# EAGLE design EL-100-020-030-AnalogOUT (EAGLE 6.6.0)

## Sheet 1 of 2
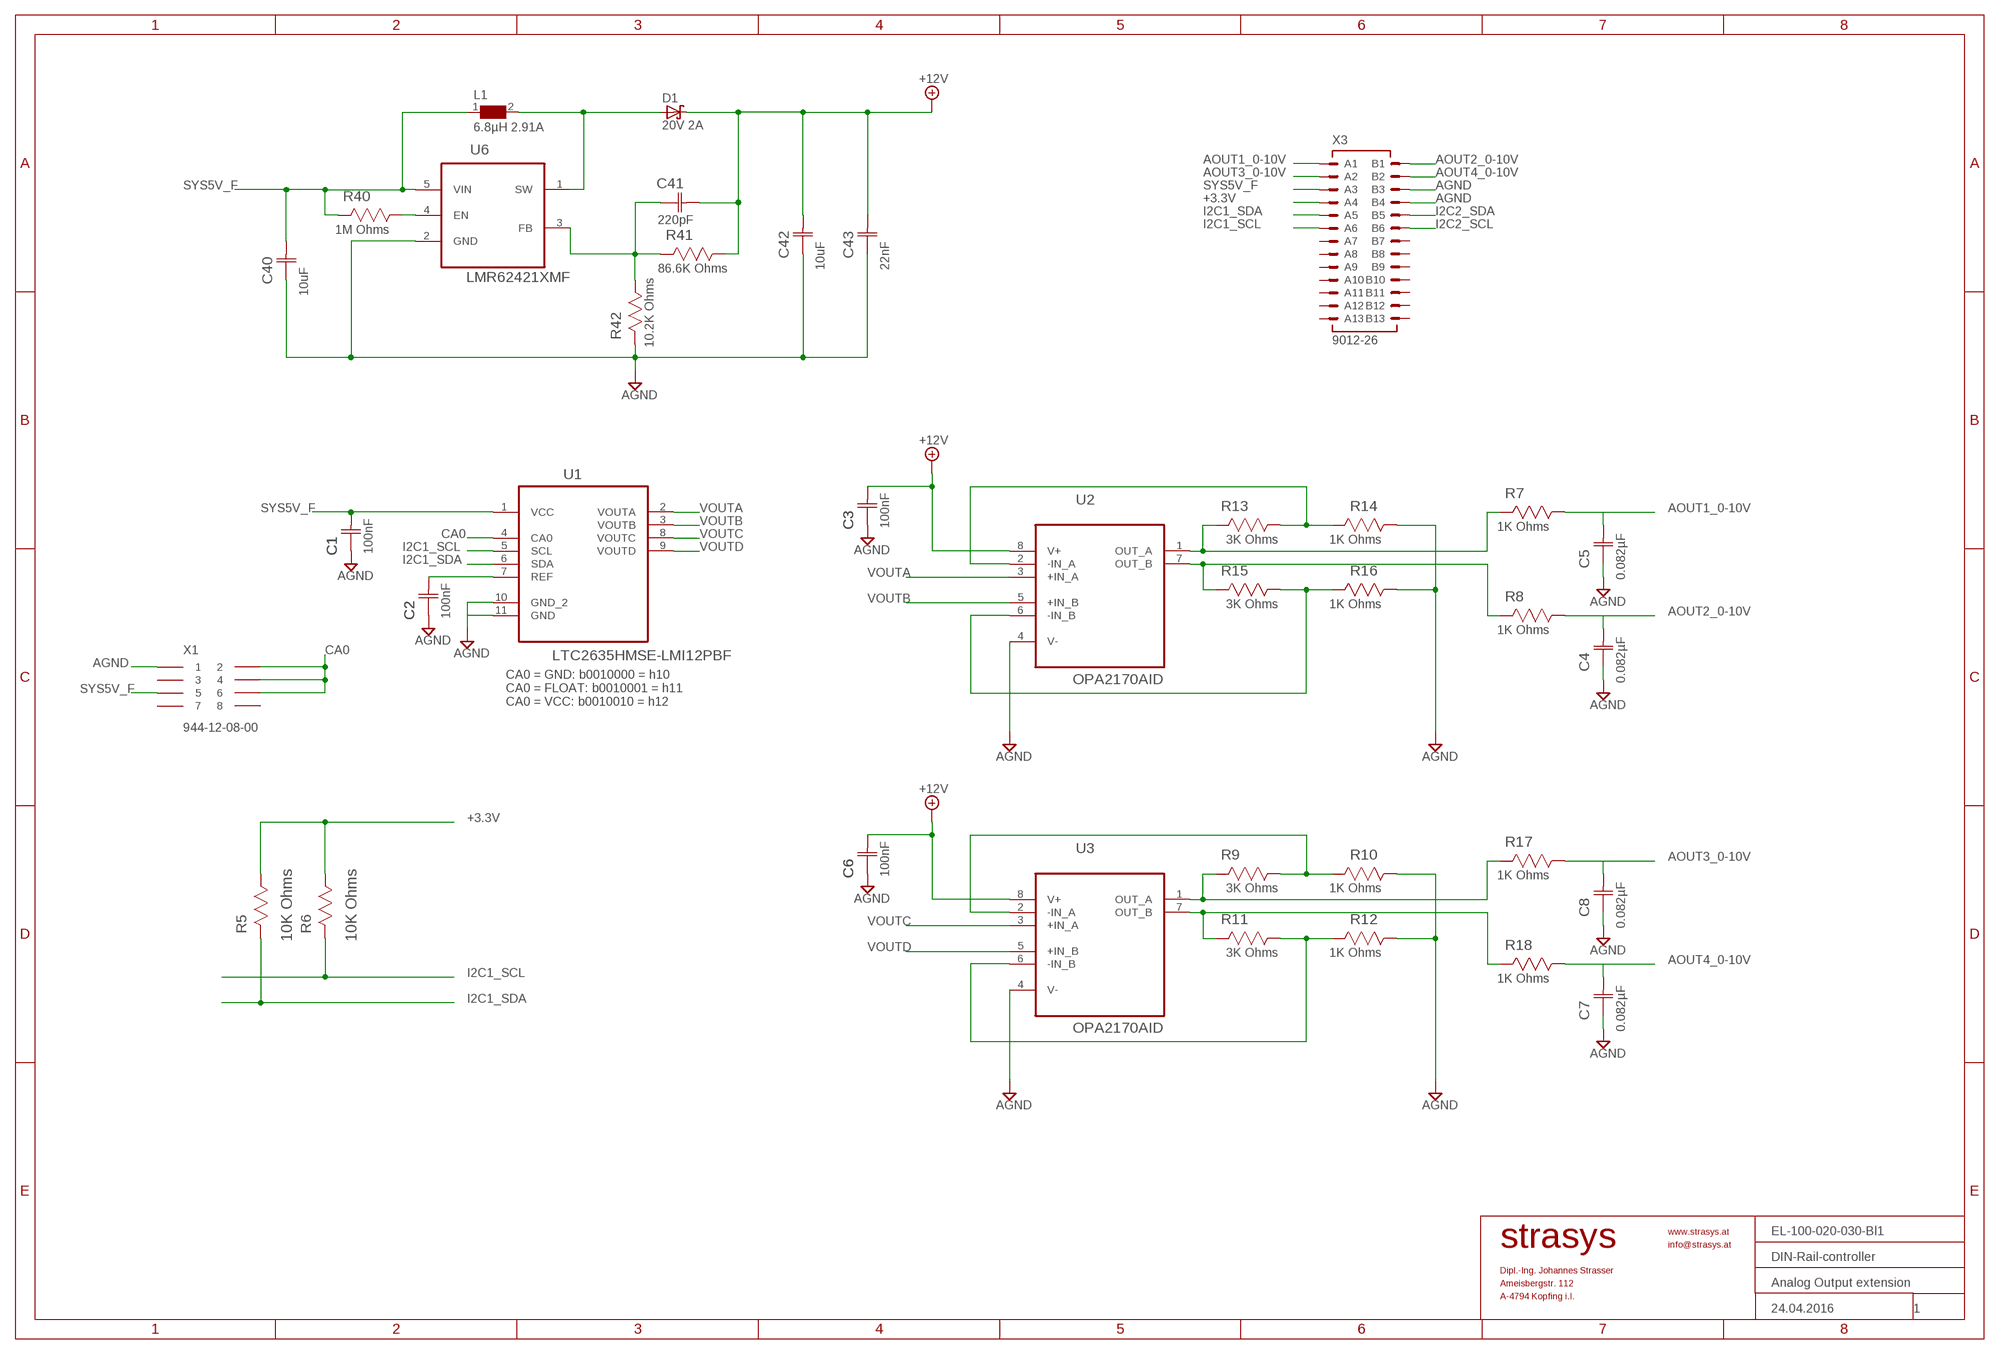
[diagram p0: schematic, sheet 1]
FRAME1 (A3L-LOC): DATE_DRAWING: 24.04.2016; DRAWING_NAME1: DIN-Rail-controller; DRAWING_NAME2: Analog Output extension; DRAWING_NO: EL-100-020-030-Bl1; PAGE: 1

### Parts
C1  100nF  C0805C104K5RACTU  [CAPC2013X110N]
C2  100nF  C0805C104K5RACTU  [CAPC2013X110N]
C3  100nF  C0805C104K5RACTU  [CAPC2013X110N]
C4  0.082µF  C0805C180J5GACTU  [CAPC2013X88N]
C5  0.082µF  C0805C180J5GACTU  [CAPC2013X88N]
C6  100nF  C0805C104K5RACTU  [CAPC2013X110N]
C7  0.082µF  C0805C180J5GACTU  [CAPC2013X88N]
C8  0.082µF  C0805C180J5GACTU  [CAPC2013X88N]
C40  10uF  C0805C106K8PACTU  [CAPC2013X140N]
C41  220pF  C0805C221J5GACTU  [CAPC2013X88N]
C42  10uF  C1206C106K3PACTU  [CAPC3216X180N]
C43  22nF  C0805C223K5RACTU  [CAPC2013X88N]
D1  20V 2A  SCHOTTKY-DIODESMD  [SMB]
L1  6.8µH 2.91A  WE-PD-7447779006_7332/7345_PLASTIC_BASE  [WE-PD_7332/7345_PLASTIC_BASE]
R5  10K Ohms  CRCW080510K0JNEA  [RESC2013X65N]
R6  10K Ohms  CRCW080510K0JNEA  [RESC2013X65N]
R7  1K Ohms  CRCW08051K00JNEA  [RESC2013X65N]
R8  1K Ohms  CRCW08051K00JNEA  [RESC2013X65N]
R9  3K Ohms  CRCW080530K0FKEA  [RESC2013X65N]
R10  1K Ohms  CRCW08051K00FKEA  [RESC2013X65N]
R11  3K Ohms  CRCW080530K0FKEA  [RESC2013X65N]
R12  1K Ohms  CRCW08051K00FKEA  [RESC2013X65N]
R13  3K Ohms  CRCW080530K0FKEA  [RESC2013X65N]
R14  1K Ohms  CRCW08051K00FKEA  [RESC2013X65N]
R15  3K Ohms  CRCW080530K0FKEA  [RESC2013X65N]
R16  1K Ohms  CRCW08051K00FKEA  [RESC2013X65N]
R17  1K Ohms  CRCW08051K00JNEA  [RESC2013X65N]
R18  1K Ohms  CRCW08051K00JNEA  [RESC2013X65N]
R40  1M Ohms  CRCW08051M00FKTB  [RESC2013X65N]
R41  86.6K Ohms  CRCW080586K6FKEA  [RESC2013X65N]
R42  10.2K Ohms  CRCW080510K2FKEA  [RESC2013X65N]
U1  LTC2635HMSE-LMI12PBF  [SOP50P490X110-11N]
U2  OPA2170AID  [SOIC127P600X175-8N]
U3  OPA2170AID  [SOIC127P600X175-8N]
U6  LMR62421XMF  [SOT95P290X145-5N]
X1  944-12-08-00  [2,54_2X8]
X3  9012-26  [9012-26]

### Nets
+3.3V: R5.1 R6.1 X3.A4 ; also sheet 2
+12V: C3.2(C2) C6.2(C2) C41.2(C2) C42.2(C2) C43.2(C2) D1.C R41.1 U2.8(V+) U3.8(V+)
AGND: C1.1(C1) C2.1(C1) C3.1(C1) C4.1(C1) C5.1(C1) C6.1(C1) C7.1(C1) C8.1(C1) C40.1(C1) C42.1(C1) C43.1(C1) R10.1 R12.1 R14.1 R16.1 R42.2 U1.10(GND_2) U1.11(GND) U2.4(V-) U3.4(V-) U6.2(GND) X1.P1 X3.B3 X3.B4 ; also sheet 2
AOUT1_0-10V: C5.2(C2) R7.1 X3.A1
AOUT2_0-10V: C4.2(C2) R8.1 X3.B1
AOUT3_0-10V: C8.2(C2) R17.1 X3.A2
AOUT4_0-10V: C7.2(C2) R18.1 X3.B2
CA0: U1.4(CA0) X1.P2 X1.P4 X1.P6
FB_LMR62: C41.1(C1) R41.2 R42.1 U6.3(FB)
I2C1_SCL: R6.2 U1.5(SCL) X3.A6
I2C1_SDA: R5.2 U1.6(SDA) X3.A5
I2C2_SCL: X3.B6 ; also sheet 2
I2C2_SDA: X3.B5 ; also sheet 2
N$2: C2.2(C2) U1.7(REF)
N$39: R40.1 U6.4(EN)
OPA21_-IN_A: R13.1 R14.2 U2.2(-IN_A)
OPA21_-IN_A1: R9.1 R10.2 U3.2(-IN_A)
OPA21_-IN_B: R15.1 R16.2 U2.6(-IN_B)
OPA21_-IN_B1: R11.1 R12.2 U3.6(-IN_B)
OPA21_AOUTB: R8.2 R15.2 U2.7(OUT_B)
OPA21_AOUTB1: R11.2 R18.2 U3.7(OUT_B)
OPA21_OUT_A: R7.2 R13.2 U2.1(OUT_A)
OPA21_OUT_A1: R9.2 R17.2 U3.1(OUT_A)
SW_LMR62: D1.A L1.2 U6.1(SW)
SYS5V_F: C1.2(C2) C40.2(C2) L1.1 R40.2 U1.1(VCC) U6.5(VIN) X1.P5 X3.A3
VOUTA: U1.2(VOUTA) U2.3(+IN_A)
VOUTB: U1.3(VOUTB) U2.5(+IN_B)
VOUTC: U1.8(VOUTC) U3.3(+IN_A)
VOUTD: U1.9(VOUTD) U3.5(+IN_B)
Unconnected: X1.P3 X1.P7 X1.P8 X3.A7 X3.A8 X3.A9 X3.A10 X3.A11 X3.A12 X3.A13 X3.B7 X3.B8 X3.B9 X3.B10 X3.B11 X3.B12 X3.B13

### Notes on the sheet
- CA0 = GND: b0010000 = h10
  CA0 = FLOAT: b0010001 = h11
  CA0 = VCC: b0010010 = h12

## Sheet 2 of 2
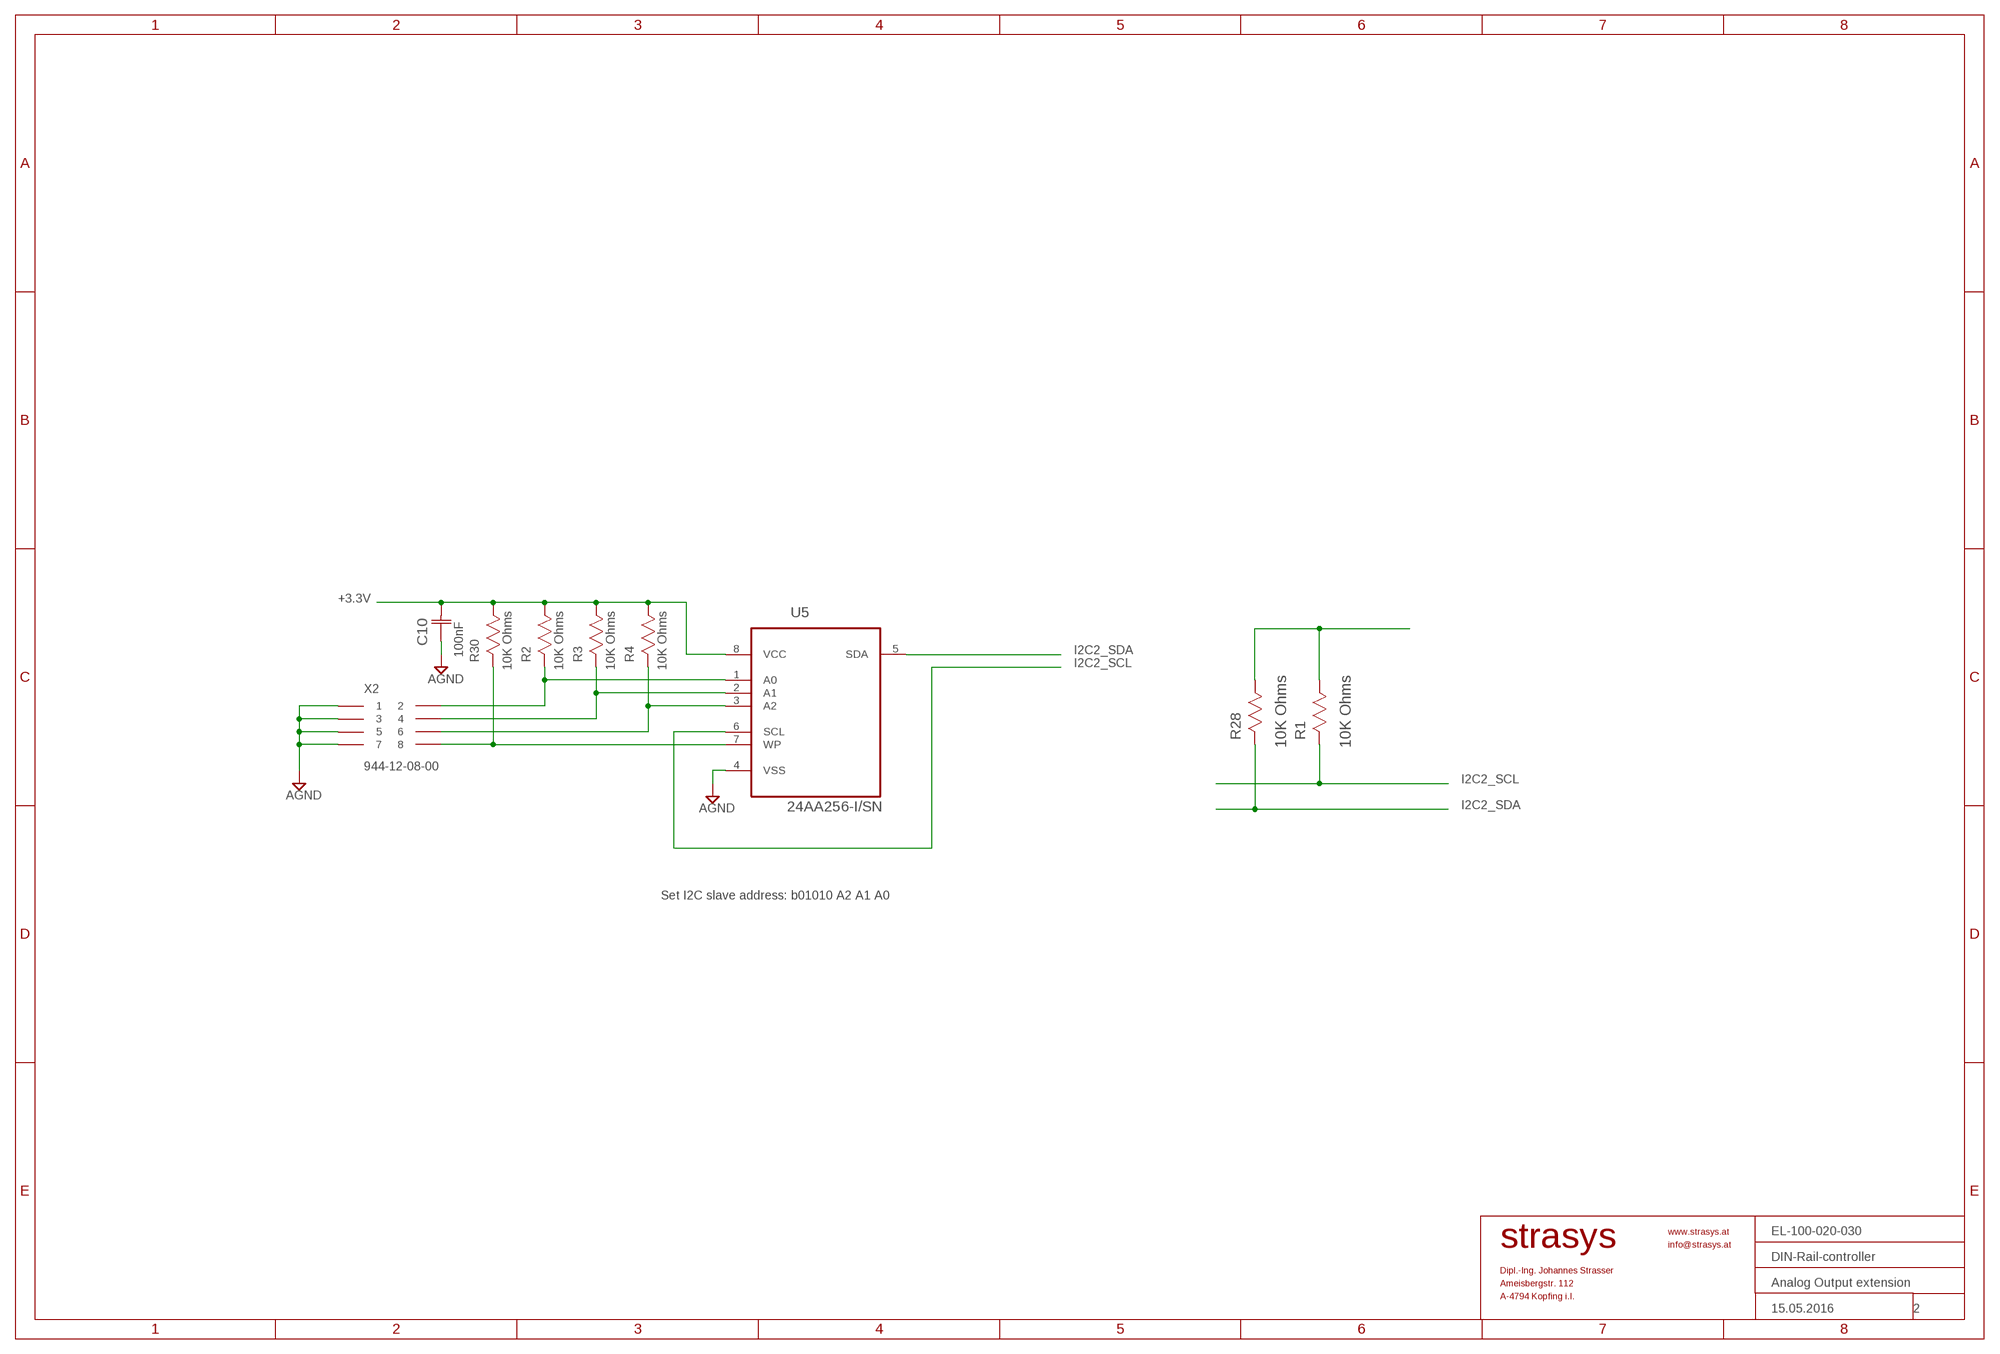
[diagram p1: schematic, sheet 2]
FRAME2 (A3L-LOC): DATE_DRAWING: 15.05.2016; DRAWING_NAME1: DIN-Rail-controller; DRAWING_NAME2: Analog Output extension; DRAWING_NO: EL-100-020-030; PAGE: 2

### Parts
C10  100nF  C0805C104K5RACTU  [CAPC2013X110N]
R1  10K Ohms  CRCW080510K0JNEA  [RESC2013X65N]
R2  10K Ohms  CRCW080510K0JNEA  [RESC2013X65N]
R3  10K Ohms  CRCW080510K0JNEA  [RESC2013X65N]
R4  10K Ohms  CRCW080510K0JNEA  [RESC2013X65N]
R28  10K Ohms  CRCW080510K0JNEA  [RESC2013X65N]
R30  10K Ohms  CRCW080510K0JNEA  [RESC2013X65N]
U5  24AA256-I/SN  [SOIC127P600X175-8N]
X2  944-12-08-00  [2,54_2X8]

### Nets
24AA-A0: R2.2 U5.1(A0) X2.P2
24AA_A1: R3.2 U5.2(A1) X2.P4
24AA_A2: R4.2 U5.3(A2) X2.P6
24AA_WP: R30.2 U5.7(WP) X2.P8
+3.3V: C10.2(C2) R1.1 R2.1 R3.1 R4.1 R28.1 R30.1 U5.8(VCC) ; also sheet 1
AGND: C10.1(C1) U5.4(VSS) X2.P1 X2.P3 X2.P5 X2.P7 ; also sheet 1
I2C2_SCL: R1.2 U5.6(SCL) ; also sheet 1
I2C2_SDA: R28.2 U5.5(SDA) ; also sheet 1

### Notes on the sheet
- Set I2C slave address: b01010 A2 A1 A0

## Library data of the parts
C1-C3 C6 = Kemet_By_element14_1:C0805C104K5RACTU: CAPACITOR, 0805; MPN: C0805C104K5RACTU; OC_FARNELL: 1414664; OC_NEWARK: 65H7431; SUPPLIER: Kemet; TOLERANCE: ±10%; VOLTAGERATING: 50V
C4 C5 C7 C8 = Kemet_By_element14_1:C0805C180J5GACTU: CAPACITOR, 0805; MPN: MC0805B823K500CT; OC_FARNELL: 1759264; SUPPLIER: MULTICOMP; TOLERANCE: ±10%; VALUE: 18pF; VOLTAGERATING: 50V
C10 = Kemet_By_element14_1:C0805C104K5RACTU: CAPACITOR, 0805; MF: KEMET; MPN: C0805C104K5RACTU; OC_FARNELL: 1414664; OC_NEWARK: 65H7431; SUPPLIER: Kemet; TOLERANCE: ±10%; VOLTAGERATING: 50V
C40 = Kemet_By_element14_Batch_1:C0805C106K8PACTU: CAPACITOR, 0805; MF: KEMET; MPN: C0805C106K8PACTU; OC_FARNELL: 1463362; OC_NEWARK: 70K9138; SUPPLIER: Kemet; TOLERANCE: ±10%; VOLTAGERATING: 10V
C41 = Kemet_By_element14_1:C0805C221J5GACTU: CAPACITOR, 0805; MF: KEMET; MPN: C0805C221J5GACTU; OC_FARNELL: 1414679; OC_NEWARK: 64K2915; SUPPLIER: Kemet; TOLERANCE: ±5%; VOLTAGERATING: 50V
C42 = Kemet_By_element14_Batch_1:C1206C106K3PACTU: CAPACITOR, 1206; MF: KEMET; MPN: C1206C106K3PACTU; OC_FARNELL: 1288206; OC_NEWARK: 88K0222; SUPPLIER: Kemet; TOLERANCE: ±10%; VOLTAGERATING: 25V
C43 = Kemet_By_element14_1:C0805C223K5RACTU: CAPACITOR, 0805; MF: KEMET; MPN: C0805C223K5RACTU; OC_FARNELL: 1414682; OC_NEWARK: 20C2718; SUPPLIER: Kemet; TOLERANCE: ±10%; VOLTAGERATING: 50V
D1 = diode:SCHOTTKY-DIODE: Schottky Diode; MF: BOURNS
L1 = WE-PD:WE-PD: SMD-Shielded Power Inductors WE-PD - Magnetically shielded version which results in a low leakage field - High storage capacity - Low self-losses - Highest possible current loading for SMD-Inducors -- Switching regulators with low operating voltages (computer, laptop, mobile phones, pagers) -- Integrated DC/DC-converter -- Is recommended for the application with switching regulators from National Semiconductor, Linear Technology, Texas Instruments and Fairchild Semiconductor, ect. -- Graphic cards -- Plastic base: Because of the one piece construction these are more suitable for high vibration or shock applications; MF: WURTH ELEKTRONIK; MPN: 7447779006; OC_FARNELL: 1635987; OC_NEWARK: 08P2857; PACKAGE: 7345; SUPPLIER: Wuerth Elektronik
R1-R6 R28 R30 = Vishay_By_element14_Batch_1:CRCW080510K0JNEA: RESISTOR, 0805; MF: VISHAY DRALORIC; MPN: CRCW080510K0JNEA; OC_FARNELL: 1469857; OC_NEWARK: 52K9797; SUPPLIER: Vishay; TOLERANCE: ±5%; WATTAGE: 0.125 W
R7 R8 R17 R18 = Vishay_By_element14_Batch_1:CRCW08051K00JNEA: RESISTOR, 0805; MPN: CRCW08051K00JNEA; OC_FARNELL: 1652937; OC_NEWARK: 52K9725; SUPPLIER: Vishay; TOLERANCE: ±5%; WATTAGE: 0.125 W
R9 R11 R13 R15 = Vishay_By_element14_Batch_1:CRCW080530K0FKEA: RESISTOR, 0805; MPN: ERA6AEB302V; OC_FARNELL: 1670234; SUPPLIER: Panasonic; TOLERANCE: ±0.1%; VALUE: 30K Ohms; WATTAGE: 0.125 W
R10 R12 R14 R16 = Vishay_By_element14_Batch_1:CRCW08051K00FKEA: RESISTOR, 0805; MPN: ERA6AEB102V; OC_FARNELL: 1577659; SUPPLIER: PANASONIC; TOLERANCE: ±0.1%; WATTAGE: 0.125 W
R40 = Vishay_By_element14_Batch_1:CRCW08051M00FKTB: RESISTOR, 0805; MF: VISHAY DRALORIC; MPN: CRCW08051M00FKTB; OC_FARNELL: 1853267; OC_NEWARK: 49P0051; SUPPLIER: Vishay Dale; TOLERANCE: ±1%; WATTAGE: 0.125W
R41 = Vishay_By_element14_Batch_1:CRCW080586K6FKEA: RESISTOR, 0805; MF: VISHAY DRALORIC; MPN: CRCW080586K6FKEA; OC_FARNELL: 1570801; OC_NEWARK: 89M6835; SUPPLIER: VISHAY DALE ELECTRONICS; TOLERANCE: ±1%; WATTAGE: 0.125 W
R42 = Vishay_By_element14_Batch_1:CRCW080510K2FKEA: RESISTOR, 0805; MF: VISHAY DRALORIC; MPN: CRCW080510K2FKEA; OC_FARNELL: 1574022; OC_NEWARK: 52K9798; SUPPLIER: VISHAY DALE ELECTRONICS; TOLERANCE: ±1%; WATTAGE: 0.125 W
U1 = strasys_standard:LTC2635HMSE-LMI12PBF: I2C VOUT DAC; MPN: LTC2635HMSE-LMI12#PBF; OC_FARNELL: 1839182; OC_NEWARK: 52R9837; PACKAGE: MSOP-10; SUPPLIER: Linear Technology
U2 U3 = strasys_standard:OPA2170AID: Low-Power OPERATIONAL AMPLIFIERS,SOIC- 8; MF: TEXAS INSTRUMENTS; MPN: OPA2170AID; OC_FARNELL: 2144252; OC_NEWARK: 05W9871; PACKAGE: SOIC- 8; SUPPLIER: TEXAS INSTRUMENTS
U5 = Microchip_By_element14_Batch_1:24AA256-I/SN: EEPROM; MF: MICROCHIP; MPN: 24AA256-I/SN; OC_FARNELL: 1331295; OC_NEWARK: 92C6874; PACKAGE: SOIC-8; SUPPLIER: MICROCHIP
U6 = strasys_standard:LMR62421XMF: IC, SIMPLE SWITCHER 24Vout, 2.1A Step-Up Voltage Regulator in SOT-23-5; MPN: LMR62421XMF; OC_FARNELL: 2064678; OC_NEWARK: 75T7401; PACKAGE: SOT-23-5; SUPPLIER: TEXAS INSTRUMENTS
X1 X2 = strasys_standard:944-12-08-00: Stiftleiste RM 2,54mm gerade 2 x 4
X3 = con-WuP:9012-26: SMT-Buchsenleiste RM 1,27mm, liegend; MPN: 9012-26; SUPPLIER: W+P

## Board
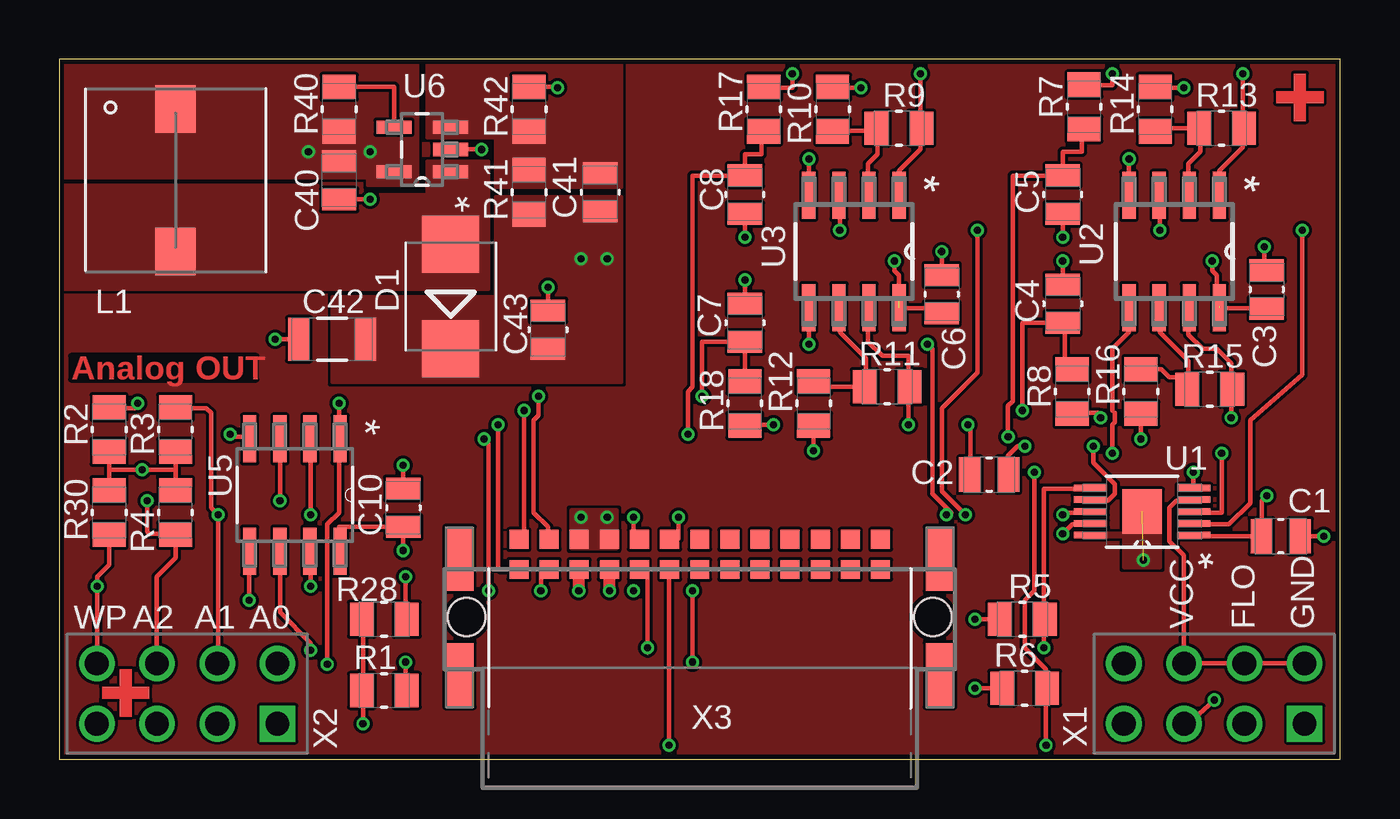
[diagram p2: board, top side]
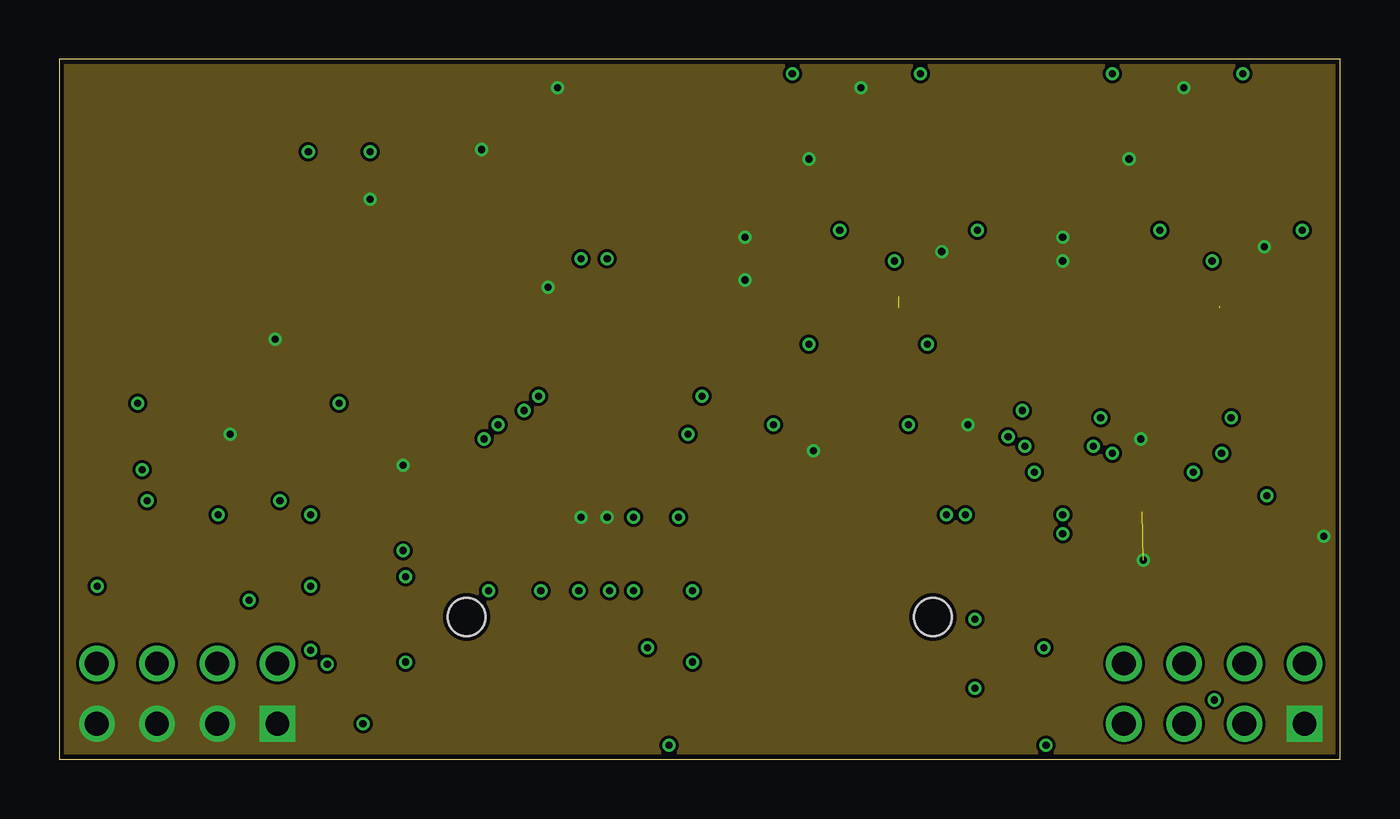
[diagram p3: board, inner layer GND]
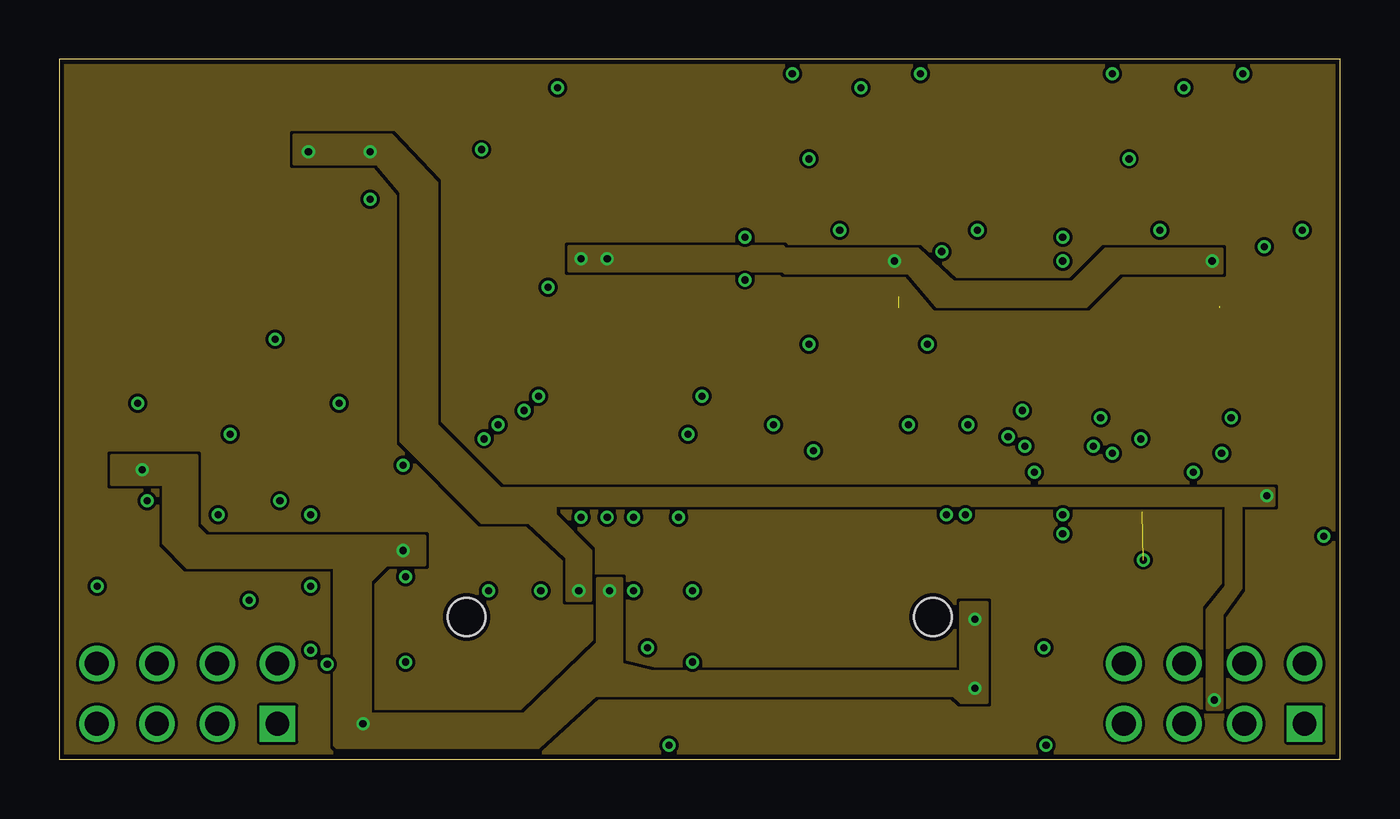
[diagram p4: board, inner layer PWR]
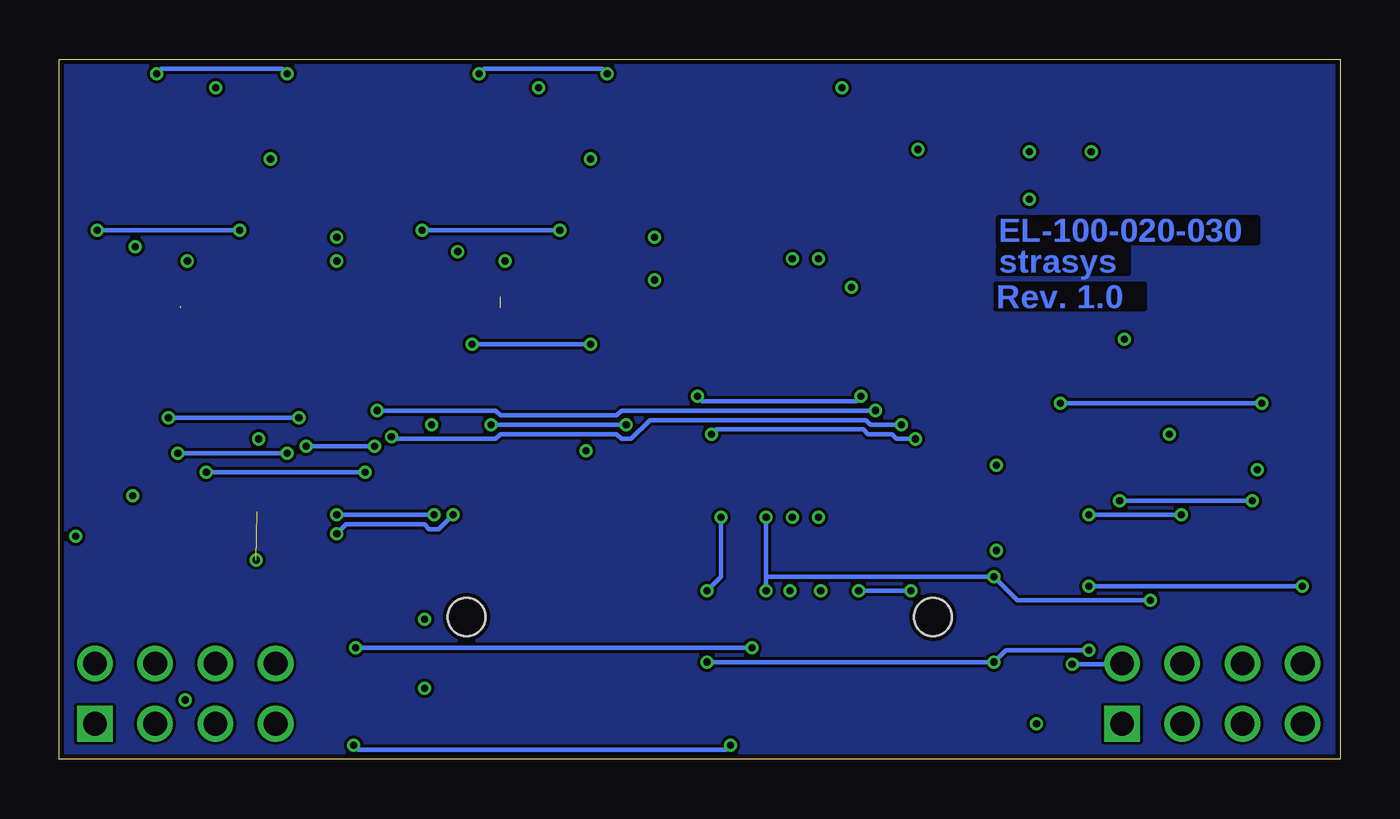
[diagram p5: board, bottom side, seen from below]

Size 54 x 29.5 mm. Coordinates in mm from the lower left corner, seen from the top.
Outline: 0,0 54,0 54,29.5 0,29.5 0,0
Copper layers (1+2*15+16): Top 0.018mm / dielectric 0.36mm / GND 0.035mm / dielectric 0.71mm / PWR 0.035mm / dielectric 0.2mm / Bottom 0.018mm
Design rules "Multi-CB_4L_125um-Tracks_OL35um-IL35um *": minimum track width 0.125mm, minimum drill 0.2mm, track to track 0.125mm, track to pad 0.125mm, pad to pad 0.125mm, via to via 0.125mm, smd to smd 0mil, copper to edge 0.2mm, drill to drill 0.2mm, minimum pad ring 0.125mm, minimum via ring 0.125mm, stop-mask expansion 2mil, vias tented up to drill 0.45mm, thermal gap 0.2mm

### Footprints (pad centres in the part's own frame; a part is rotated, then mirrored left to right if it is on the bottom)
CAPC2013X110N = smd 0.914 x 1.448: 1 -0.813,0; 2 0.813,0
CAPC2013X88N = smd 0.914 x 1.448: 1 -0.813,0; 2 0.813,0
CAPC2013X140N = smd 0.914 x 1.448: 1 -0.813,0; 2 0.813,0
CAPC3216X180N = smd 0.914 x 1.803: 1 -1.397,0; 2 1.397,0
SMB = smd 2.4 x 2.4: A 2.2,0; C -2.2,0
WE-PD_7332/7345_PLASTIC_BASE = smd 1.7 x 2: 1 0,3; 2 0,-3
RESC2013X65N = smd 1.016 x 1.397: 1 -0.94,0; 2 0.94,0
SOP50P490X110-11N = smd 1.397 x 0.279: 1 -2.184,0.991; 2 -2.184,0.508; 3 -2.184,0; 4 -2.184,-0.508; 5 -2.184,-0.991; 6 2.184,-0.991; 7 2.184,-0.508; 8 2.184,0; 9 2.184,0.508; 10 2.184,0.991 | smd 1.676 x 1.88: 11 0,0
SOIC127P600X175-8N = smd 1.981 x 0.559: 1 -2.362,1.905; 2 -2.362,0.635; 3 -2.362,-0.635; 4 -2.362,-1.905; 5 2.362,-1.905; 6 2.362,-0.635; 7 2.362,0.635; 8 2.362,1.905
SOT95P290X145-5N = smd 1.473 x 0.559: 1 -1.194,0.94; 2 -1.194,0; 3 -1.194,-0.94; 4 1.194,-0.94; 5 1.194,0.94
2,54_2X8 = drill 1 square: P1 0,0 | drill 1: P2 0,-2.54; P3 2.54,0; P4 2.54,-2.54; P5 5.08,0; P6 5.08,-2.54; P7 7.62,0; P8 7.62,-2.54
9012-26 = smd 0.8 x 0.8: A1 -7.62,2; A2 -6.35,2; A3 -5.08,2; A4 -3.81,2; A5 -2.54,2; A6 -1.27,2; A7 0,2; A8 1.27,2; A9 2.54,2; A10 3.81,2; A11 5.08,2; A12 6.35,2; A13 7.62,2; B1 -7.62,3.27; B2 -6.35,3.27; B3 -5.08,3.27; B4 -3.81,3.27; B5 -2.54,3.27; B6 -1.27,3.27; B7 0,3.27; B8 1.27,3.27; B9 2.54,3.27; B10 3.81,3.27; B11 5.08,3.27; B12 6.35,3.27; B13 7.62,3.27 | smd 1.2 x 2.7: M1 -10.13,2.45; M2 -10.13,-2.45; M3 10.13,2.45; M4 10.13,-2.45 | hole 1.6: -9.83,0; 9.83,0

### Placement (x,y rotation side)
C1  51.5,9.4 180 top
C2  39.2,12 0 top
C3  50.9,19.8 270 top
C4  42.3,19.2 270 top
C5  42.3,23.8 90 top
C6  37.2,19.6 270 top
C7  28.9,18.4 270 top
C8  28.9,23.8 90 top
C10  14.5,10.6 270 top
C40  11.8,24.4 90 top
C41  22.8,23.9 270 top
C42  11.5,17.7 0 top
C43  20.6,18.1 270 top
D1  16.5,19.5 90 top
L1  4.9,24.4 0 top
R1  13.7,2.9 0 top
R2  2.1,13.9 90 top
R3  4.9,13.9 90 top
R4  4.9,10.4 270 top
R5  40.6,5.9 0 top
R6  40.7,3 0 top
R7  43.2,27.5 90 top
R8  42.7,15.5 270 top
R9  35.4,26.6 0 top
R10  32.6,27.4 270 top
R11  34.9,15.7 0 top
R12  31.8,15 90 top
R13  49,26.6 0 top
R14  46.2,27.4 270 top
R15  48.5,15.6 0 top
R16  45.6,15.5 90 top
R17  29.7,27.4 90 top
R18  28.9,15 270 top
R28  13.7,5.9 0 top
R30  2.1,10.4 270 top
R40  11.8,27.4 270 top
R41  19.8,23.9 90 top
R42  19.8,27.4 90 top
U1  45.65,10.44 180 top
U2  47,21.4 270 top
U3  33.5,21.4 270 top
U5  9.93,11.14 270 top
U6  15.3,25.7 180 top
U$1  [PASSER_SMD4]  2.8,2.8 0 top
U$2  [PASSER_SMD4]  52.3,27.9 0 top
X1  52.5,1.5 180 top
X2  9.2,1.5 180 top
X3  27,6 0 top

### Tracks (layer width: path | path; a pad name or v marks a point on that pad's centre or on a via)
24AA-A0  (via drill 0.3)
  Top 0.2: v11.3,4 11.3,9.9 11.8,10.4 11.8,13.5 U5.1 11.8,13.6 v11.8,15 | v3.3,15 3.3,14.9 3.2,14.8 2.1,14.8 R2.2
  Bottom 0.2: v11.3,4 9.2,4 X2.P2 | v3.3,15 v11.8,15
24AA_A1  (via drill 0.3)
  Top 0.2: v10.6,10.3 10.6,13.5 U5.2 | X2.P4 6.7,4.1 v6.7,10.3 6.4,10.6 6.4,14.6 6.2,14.8 4.9,14.8 R3.2
  Bottom 0.2: v6.7,10.3 v10.6,10.3
24AA_A2  (via drill 0.3)
  Top 0.2: X2.P6 4.1,4.1 4.1,7.7 4.9,8.5 R4.2 4.9,9.5 3.8,9.5 3.7,9.6 v3.7,10.9 | v9.3,10.9 U5.3
  Bottom 0.2: v3.7,10.9 v9.3,10.9
24AA_WP  (via drill 0.3)
  Top 0.2: X2.P8 1.6,4.1 v1.6,7.3 1.6,7.7 2.1,8.2 R30.2 | v10.6,7.3 10.6,8.7 U5.7
  Bottom 0.2: v1.6,7.3 v10.6,7.3
+3.3V  (via drill 0.3)
  Top 0.2: v38.6,5.9 R5.1 | v38.6,3 R6.1 | R4.1 R3.1 4.9,12.2 v3.5,12.2 2.1,12.2 R2.1 R30.1 | v14.5,8.8 C10.2 11.8,9.8 11.8,8.8 U5.8 | v12.8,1.5 12.8,2.9 | 12.8,2.9 12.8,5.9 R28.1 | 12.8,2.9 R1.1
  Top 0.5: v23.2,7.1 X3.A4
  pour PWR (no thermals): 22.7,7.6 22.7,4.9 19.6,1.9 13.1,1.9 13.1,7.5 13.8,8.2 15.4,8.2 15.4,9.4 6.2,9.4 5.8,9.8 5.8,12.8 2.2,12.8 2.2,11.6 4.4,11.6 4.4,9.1 5.4,8.1 11.6,8.1 11.6,0.6 11.7,0.5 20.2,0.5 22.6,2.7 37.7,2.7 38,2.4 39.1,2.4 39.1,6.6 38,6.6 38,3.7 25,3.7 23.7,4 23.7,7.6
+12V  (via drill 0.3)  (2 unrouted)
  Top 0.2: U3.8 35.5,19 37.2,19 C6.2 37.2,18.7 | U2.8 49,19 C3.2 | v35.2,21 35.2,20.6 35.4,20.4 35.4,19.5 | v48.6,21 48.6,20.6 48.8,20.4 48.8,19.2 48.9,19.1
  other vias: 23.1,21.1 22,21.1
  pour Top (rank 2, no thermals): 11.5,19.3 18.4,19.3 18.4,23.7 23.7,23.7 23.7,15.9 11.5,15.9
  pour PWR (no thermals): 21.5,21.6 30.5,21.6 30.6,21.5 36.2,21.5 37.7,20.1 42.7,20.1 44.1,21.5 49,21.5 49,20.5 44.7,20.5 43.3,19.1 37,19.1 35.8,20.5 30.6,20.5 30.5,20.6 21.5,20.6
  pour Top (rank 2, no thermals): 11.5,19.4 18.4,19.4 18.4,23.7 23.7,23.7 23.7,16 11.5,16
  pour Top (rank 2, no thermals): 11.5,19.5 18.4,19.5 18.4,23.7 23.7,23.7 23.7,16.1 11.5,16.1
AGND  (via drill 0.3)  (1 unrouted)
  Top 0.2: v9.1,17.7 C42.1 | v17.8,25.7 U6.2 | v20.6,19.9 C43.1 | R42.2 21,28.34 v21,28.3 | v13.1,23.6 C40.1 | v33.8,28.3 32.6,28.3 R10.1 | v31.6,25.3 31.6,23.8 U3.4 | v31.8,13 R12.1 | v28.9,22 C8.1 | v28.9,20.2 C7.1 | v47.4,28.3 46.2,28.3 R14.1 | v45.1,25.3 v45.09,25.3 U2.4 | C5.1 v42.3,22 | C4.1 v42.3,21 | v45.6,13.5 R16.1 | C10.1 v14.5,12.4 | v7.2,13.7 7.2,13.6 8,13.6 U5.4 | v38.3,14.1 38.4,14 C2.1 | v53.3,9.4 C1.1 | v37.2,21.4 C6.1 | v50.8,21.6 50.8,20.6 C3.1
  other vias: 22,10.2 23.1,10.2 45.7,8.4
  pour GND (no thermals): 0,29.5 54,29.5 54,0 0,0
  pour Top (no thermals): 21.6,8.9 21.6,10.5 23.5,10.5 23.5,8.9
  pour Top (no thermals): 43.8,9.5 46.4,9.5 46.4,8.1 44.9,8.1 44.9,9.4 43.8,9.4
AOUT1_0-10V  (via drill 0.3)
  Top 0.2: R7.1 43.2,26.6 43.1,26.6 43.1,25.6 42.3,25.6 C5.2 40.2,24.6 40.2,15.1 40,14.9 v40,13.6 | v18.5,14.1 18.5,8.1 18.6,8 X3.A1
  Bottom 0.2: v40,13.6 39.9,13.5 35.6,13.5 35.4,13.7 30.5,13.7 30.3,13.5 29.9,13.5 29.1,14.3 20,14.3 19.8,14.1 v18.5,14.1
AOUT2_0-10V  (via drill 0.3)
  Top 0.2: C4.2 42.4,18.4 42.4,16.4 42.7,16.4 R8.1 | v40.6,14.7 40.6,18.4 C4.2 | v19.6,14.7 19.6,9.4 19.4,9.2 X3.B1 | C4.2
  Bottom 0.2: v40.6,14.7 35.6,14.7 35.4,14.5 30.5,14.5 30.3,14.7 v19.6,14.7
AOUT3_0-10V  (via drill 0.3)
  Top 0.2: R17.1 29.7,26.5 29.6,26.5 29.6,25.5 28.9,25.5 C8.2 26.7,24.6 26.7,15.7 26.5,15.5 v26.5,13.7 | v17.9,13.5 18.1,13.3 v18.1,7.1 | v20.3,7.1 20.3,8 X3.A2
  Bottom 0.2: v26.5,13.7 26.3,13.9 20.1,13.9 19.9,13.7 18.9,13.7 18.7,13.5 v17.9,13.5 | v20.3,7.1 v18.1,7.1
AOUT4_0-10V  (via drill 0.3)
  Top 0.2: R18.1 C7.2 27.1,17.6 v27.1,15.3 | v20.2,15.3 20.2,14.5 20,14.3 20,10.4 20.6,9.8 20.6,9.3 X3.B2
  Bottom 0.2: v27.1,15.3 26.9,15.1 20.4,15.1 v20.2,15.3
CA0
  Top 0.2: U1.4 47.8,10.9 47.1,10.9 46.8,10.6 46.8,9.2 47.4,8.6 47.4,4.1 X1.P6 X1.P4 X1.P2
FB_LMR62
  pour Top (rank 2, no thermals): 23.7,24.1 18.4,24.1 18.4,26.2 15.5,26.2 15.5,29.5 23.7,29.5
I2C1_SCL  (via drill 0.3)
  Top 0.2: v25.7,0.6 25.7,8 X3.A6 | v41.6,0.6 41.6,3 | v47.8,12.1 47.8,11.5 U1.5 | v41.1,12.1 41.1,7.1 40.7,6.7 40.7,4.7 41.6,3.8 41.6,3 | 41.6,3 R6.2
  Bottom 0.2: v41.6,0.6 41.4,0.4 25.9,0.4 v25.7,0.6 | v41.1,12.1 v47.8,12.1
I2C1_SDA  (via drill 0.3)
  Top 0.2: 24.8,4.5 v24.8,4.7 24.8,7.9 24.7,8 X3.A5 | v41.5,4.7 41.5,5.9 | 41.5,5.9 41.5,11.4 43.4,11.4 U1.6 | 41.5,5.9 R5.2
  Bottom 0.2: v24.8,4.7 v41.5,4.7
I2C2_SCL  (via drill 0.3)
  Top 0.2: v26.1,10.2 26.1,9.3 25.8,9.3 X3.B6 | v14.6,4.1 14.6,2.9 R1.2 | v26.7,7.1 v26.7,4.1 | v10.6,4.6 10.6,4.9 9.3,6.2 9.3,8.7 U5.6
  Bottom 0.2: v26.7,7.1 26.1,7.7 v26.1,10.2 | v26.7,4.1 v14.6,4.1 14.1,4.6 v10.6,4.6
I2C2_SDA  (via drill 0.3)
  Top 0.2: 24.2,9.27 X3.B5 24.2,9.3 v24.2,10.2 | v14.6,7.7 14.6,5.9 R28.2 | v8,6.7 8,8.7 U5.5
  Bottom 0.2: v24.2,10.2 24.2,7.7 | 24.2,7.7 v24.2,7.1 | 24.2,7.7 v14.6,7.7 13.6,6.7 v8,6.7
N$2  (via drill 0.3)
  Top 0.2: v43.6,13.2 43.6,12.5 44.5,11.6 44.5,11.2 44.2,10.9 43.5,10.9 U1.7 | v40.7,13.2 40.4,13.2 40,12.8 C2.2
  Bottom 0.2: v40.7,13.2 v43.6,13.2
N$39
  Top 0.2: R40.1 14.11,28.34 U6.4
OPA21_-IN_A
  Top 0.2: U2.2 47.6,23.8 47.6,25.1 48.1,25.6 48.1,26.7 R13.1 46.2,26.6 R14.2
OPA21_-IN_A1
  Top 0.2: U3.2 34.1,23.8 34.1,25.1 34.5,25.5 34.5,26.6 R9.1 34.4,26.6 34.4,26.5 32.6,26.5 R10.2
OPA21_-IN_B
  Top 0.2: U2.6 46.4,19 46.4,18 47.6,16.8 47.6,15.6 R15.1 47.06,16.1 46.8,16.1 46.46,16.44 R16.2
OPA21_-IN_B1
  Top 0.2: U3.6 32.9,19 32.9,18 34,16.9 34,15.7 R11.1 31.8,15.7 R12.2
OPA21_AOUTB  (via drill 0.3)
  Top 0.2: U2.7 47.6,19 47.6,17.9 48.2,17.3 48.8,17.3 49.4,16.7 49.4,15.64 R15.2 49.4,15.6 v49.4,14.4 | v43.9,14.4 43.9,14.5 43.8,14.6 42.7,14.6 R8.2
  Bottom 0.2: v43.9,14.4 v49.4,14.4
OPA21_AOUTB1  (via drill 0.3)
  Top 0.2: U3.7 34.1,19 34.1,17.6 34.7,17 35.8,17 35.8,15.7 | v35.8,14.1 35.8,15.7 | v30.1,14.1 28.9,14.1 R18.2 | 35.8,15.7 R11.2
  Bottom 0.2: v30.1,14.1 v35.8,14.1
OPA21_OUT_A  (via drill 0.3)
  Top 0.2: v44.4,28.9 44.4,28.4 43.2,28.4 R7.2 | 49.9,26.7 v49.9,28.9 | 49.9,26.7 49.9,25.8 48.9,24.8 48.9,23.8 U2.1 | 49.9,26.7 R13.2
  Bottom 0.2: v44.4,28.9 44.6,29.1 49.7,29.1 v49.9,28.9
OPA21_OUT_A1  (via drill 0.3)
  Top 0.2: v30.9,28.9 30.9,28.3 29.7,28.3 R17.2 | 36.3,26.6 v36.3,28.9 | 36.3,26.6 36.3,25.7 35.4,24.8 35.4,23.8 U3.1 | 36.3,26.6 R9.2
  Bottom 0.2: v30.9,28.9 31.1,29.1 36.1,29.1 v36.3,28.9
PE
  pour Top (rank 6): 0,29.5 54,29.5 54,0 0,0
  pour PWR (rank 6): 0.1,29.5 54,29.5 54,0 0,0 0,29.5
  pour Bottom (rank 6): 0,29.5 0,0 54,0 54,29.5
SW_LMR62
  pour Top (rank 2, no thermals): 0,24.1 10.9,24.1 10.9,23.8 15.5,23.8 15.5,25.2 18.1,25.2 18.1,19.8 0,19.8
  pour Top (rank 2, no thermals): 0,24.1 10.9,24.1 10.9,23.8 15.5,23.8 15.5,25.2 18.1,25.2 18.1,19.8 0,19.8
  pour Top (rank 2, no thermals): 0,24.2 10.9,24.2 10.9,23.8 15.5,23.8 15.5,25.2 18.1,25.2 18.1,19.8 0,19.8
SYS5V_F  (via drill 0.3)
  Top 0.2: v50.9,11.1 50.7,10.9 C1.2 47.88,9.4 U1.1 | X1.P5 47.6,1.5 v48.7,2.5
  Top 0.5: v21.9,7.1 21.9,8 X3.A3
  other vias: 10.5,25.6 13.1,25.6
  pour Top (rank 2, no thermals): 0,29.5 15.1,29.5 15.1,24.2 13,24.2 13,24.5 0,24.5
  pour PWR (no thermals): 21.4,6.7 22.4,6.7 22.4,8.8 20.9,10.3 20.9,10.7 49.2,10.7 49.2,7.3 48.4,6.3 48.4,2.1 49,2.1 49,6.1 49.8,7.2 49.8,10.7 51.2,10.7 51.2,11.4 18.6,11.4 15.9,14.1 15.9,24.3 14,26.3 9.9,26.3 9.9,25.1 13.4,25.1 14.4,23.9 14.4,13.4 17.8,10 19.8,10 21.4,8.5
VOUTA  (via drill 0.3)
  Top 0.2: v52.4,22.3 52.4,16.2 50.2,14.3 50.2,10.8 49.3,9.9 47.9,9.9 U1.2 | v46.4,22.3 46.4,23.7 U2.3
  Bottom 0.2: v46.4,22.3 v52.4,22.3
VOUTB  (via drill 0.3)
  Top 0.2: v49,12.9 49,10.4 47.9,10.4 U1.3 | v44.4,12.9 44.4,14.1 44.5,14.2 44.5,14.6 44.4,14.7 44.4,17.3 45.1,18 45.1,19 U2.5
  Bottom 0.2: v44.4,12.9 v49,12.9
VOUTC  (via drill 0.3)
  Top 0.2: v38.2,10.3 37.2,11.3 37.2,14.8 38.7,16.3 v38.7,22.3 | v32.9,22.3 32.9,23.7 U3.3 | v42.3,10.3 42.3,10.4 43.4,10.4 U1.8
  Bottom 0.2: v32.9,22.3 v38.7,22.3 | v38.2,10.3 v42.3,10.3
VOUTD  (via drill 0.3)
  Top 0.2: v36.6,17.5 36.8,17.3 36.8,11.2 37.6,10.4 37.4,10.4 v37.4,10.3 | v31.6,17.5 31.6,19 U3.5 | v42.3,9.5 42.7,9.9 43.4,9.9 U1.9
  Bottom 0.2: v31.6,17.5 v36.6,17.5 | v37.4,10.3 38,9.7 38.4,9.7 38.6,9.9 41.9,9.9 v42.3,9.5

### Text on the board
Top: Analog OUT
Bottom: EL-100-020-030 | strasys | Rev. 1.0
tNames: WP | A2 | A1 | A0 | VCC | FLO | GND